# Altium schematic sheet WE_1100 [USB_Type_C].SchDoc: not used
size A3; Date: not used; Author: not used; CompanyName: Würth Elektronik eiSos GmbH & Co. KG; Engineer: not used; Organization: not used; Address1: Max-Eyth-Str. 1; Address2: 74638 Waldenburg; Address3: not used; Address4: Germany; DocumentNumber: 1; Revision: not used; SheetNumber: 1; SheetTotal: 2; PageSetup: Record=PageOptions|CenterHorizontal=True|CenterVertical=True|PrintScale=0.97|XCorrection=1.00|YCorrection=1.00|PrintKind=0|BorderSize=5000000|LeftOffset=0|BottomOffset=0|Orientation=1|PaperLength=1000|PaperWidth=1000|Scale=100|PaperSource=7|PrintQuality=600|MediaType=1|DitherType=10|PaperKind=A4|PrintScaleMode=1; CurrentTime: not used; CurrentDate: not used; Time: not used; DocumentFullPathAndName: not used; ModifiedDate: not used; ImagePath: not used; ProjectName: not used
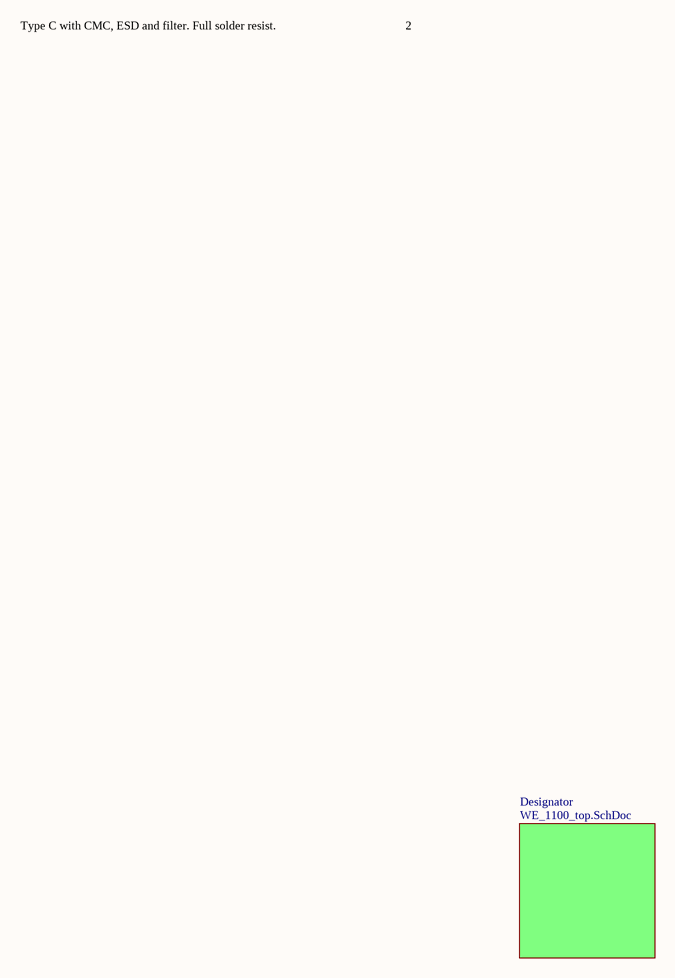
[diagram p0: WE_1100 [USB_Type_C].SchDoc]

## Sub-sheets
Designator = WE_1100_top.SchDoc: no entries

## Notes on the sheet
- Type C with CMC, ESD and filter. Full solder resist.
- 2
- Function
- Cover sheet
- Sheet Number
- 1
- Projekt Top Sheet
- Approvals
- Date
- Company Name
- Drawn
- Checked
- Issued
- Project Name
- WÜRTH ELEKTRONIK EISOS APPLICATION DESIGN SERVICE DISCLAIMER
  THE USE OF THE WÜRTH ELEKTRONIK EISOS APPLICATION DESIGN SERVICE IS ENTIRELY AT THE OWN RISK OF THE BUSINESS PARTNER. THE WÜRTH ELEKTRONIK EISOS APPLICATION DESIGN SERVICE IS PROVIDED ON AN "AS IS" OR "AS AVAILABLE" BASIS, WITHOUT ANY WARRANTIES OF ANY KIND. WÜRTH ELEKTRONIK EISOS DISCLAIMS ANY WARRANTIES FOR THE SECURITY, RELIABILITY, TIMELINESS, ACCURACY, AND PERFORMANCE OF THE WÜRTH ELEKTRONIK EISOS APPLICATION DESIGN SERVICE. TO THE FULLEST EXTENT PERMITTED BY LAW, WÜRTH ELEKTRONIK EISOS APPLICATION DESIGN SERVICE DISCLAIMS ANY WARRANTIES FOR OTHER SERVICES OR GOODS RECEIVED THROUGH OR ADVERTISED ON THE WÜRTH ELEKTRONIK EISOS SITE OR THE SITES OR SERVICE, OR ACCESSED THROUGH ANY LINKS ON THE WÜRTH ELEKTRONIK EISOS SITE, CONNECTION WITH THE WÜRTH ELEKTRONIK EISOS SITE OR THE WÜRTH ELEKTRONIK EISOS APPLICATION DESIGN SERVICE. UNDER NO CIRCUMSTANCES SHALL THE WÜRTH ELEKTRONIK EISOS BE LIABLE FOR DAMAGES INCURRED BY REASON OF OTHER SERVICES OR PRODUCTS RECEIVED THROUGH OR ADVERTISED IN CONNECTION WITH THE WÜRTH ELEKTRONIK EISOS SITE OR THE WÜRTH ELEKTRONIK EISOS APPLICATION DESIGN SERVICE.
- Rev
- No
- Size
- SVN
- A3
- Project Number
- PCB Number
- Processed
- File
- Sheet
- of